# Altium project Heartbeat_board.PrjPcb
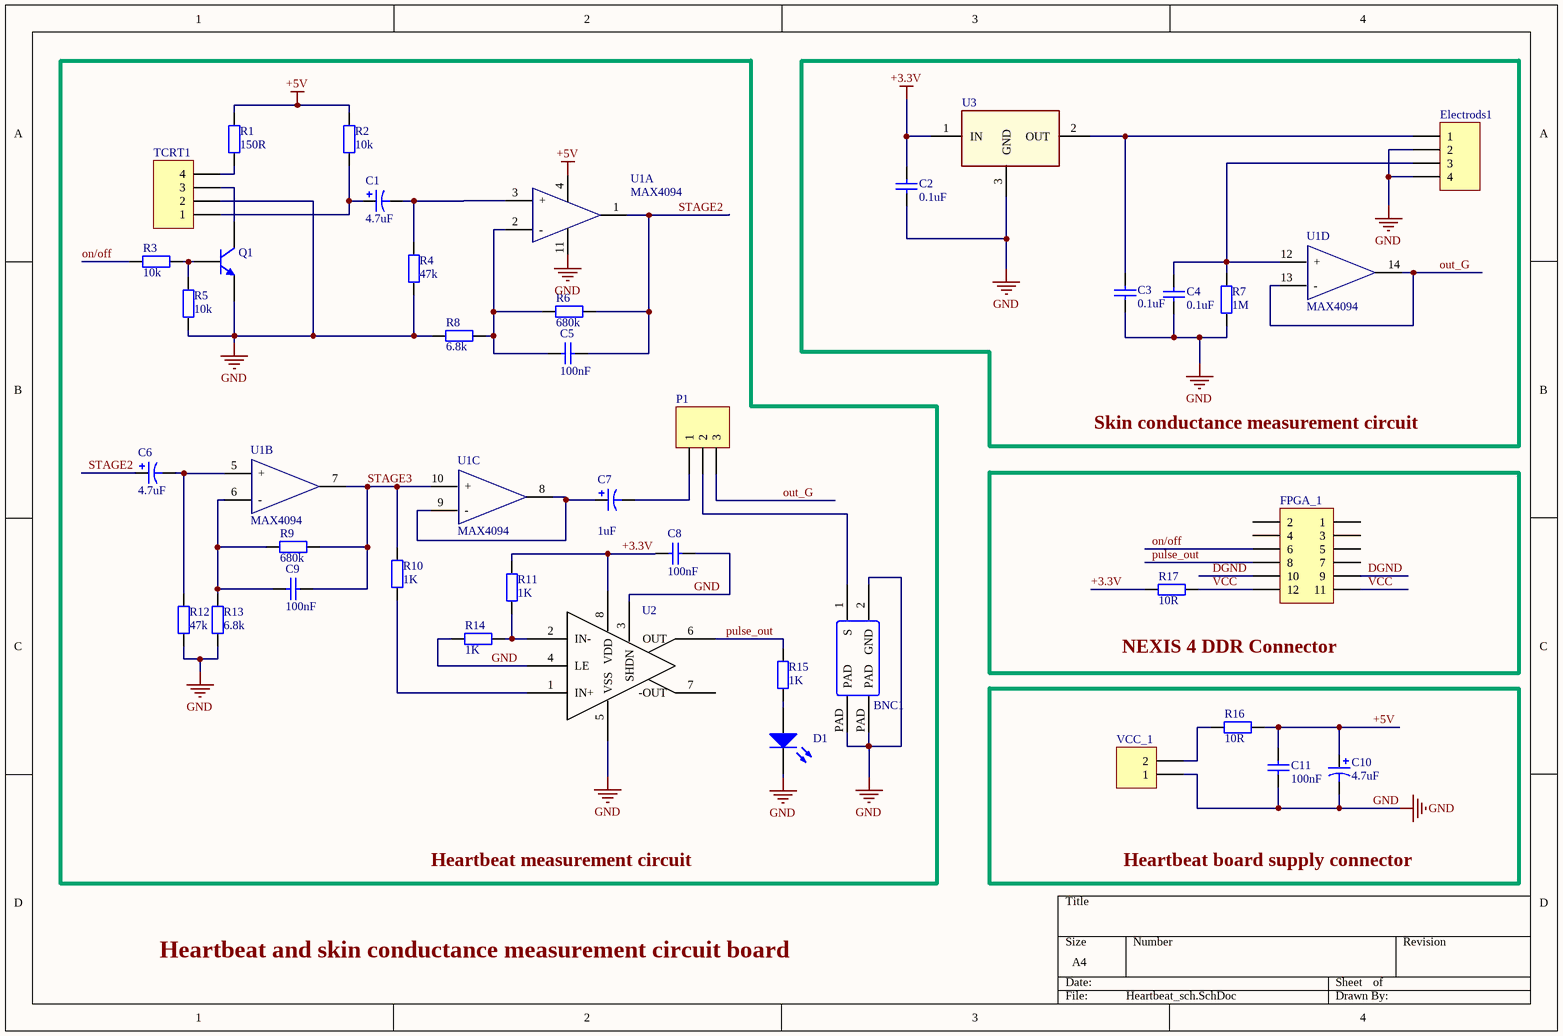
[diagram p0: Heartbeat_sch.SchDoc]
1 sheet, 39 parts. Net scope: global (net labels, ports and power ports of the same name join across sheets).
Board file: Heartbeat_pcb.PcbDoc

## Sheet Heartbeat_sch.SchDoc
size A4

### Parts
BNC1  BNC FEMALE CONN  [BNC CONNECTOR]  (value not drawn)
C1  value 4.7uF  [Condensator SMD tantal case A]  (hidden comment: Cap Pol1)
C2  value 0.1uF  [capacitor 2012[0805]]  (hidden comment: Cap)
C3  value 0.1uF  [capacitor 2012[0805]]  (hidden comment: Cap)
C4  value 0.1uF  [capacitor 2012[0805]]  (hidden comment: Cap)
C5  value 100nF  [capacitor 2012[0805]]  (hidden comment: Cap)
C6  value 4.7uF  [Condensator SMD tantal case A]  (hidden comment: Cap Pol1)
C7  value 1uF  [Condensator SMD tantal case A]  (hidden comment: Cap Pol1)
C8  value 100nF  [capacitor 2012[0805]]  (hidden comment: Cap)
C9  value 100nF  [capacitor 2012[0805]]  (hidden comment: Cap)
C10  value 4.7uF  [Condensator SMD tantal case A]  (hidden comment: Cap Pol1)
C11  value 100nF  [capacitor 2012[0805]]  (hidden comment: Cap)
D1  LED0  [led smd verde]  (value not drawn)
Electrods1  Header 4H  [HDR1X4H]  (value not drawn)
FPGA_1  Header 6X2H  [HDR2X6H]  (value not drawn)
P1  Header 3  [hdr3]  (value not drawn)
Q1  2N3904  [SOT23-3M]  (value not drawn)
R1  value 150R  [2012(rezistor)]  (hidden comment: Res2)
R2  value 10k  [2012(rezistor)]  (hidden comment: Res2)
R3  value 10k  [2012(rezistor)]  (hidden comment: Res2)
R4  value 47k  [2012(rezistor)]  (hidden comment: Res2)
R5  value 10k  [2012(rezistor)]  (hidden comment: Res2)
R6  value 680k  [2012(rezistor)]  (hidden comment: Res2)
R7  value 1M  [2012(rezistor)]  (hidden comment: Res2)
R8  value 6.8k  [2012(rezistor)]  (hidden comment: Res2)
R9  value 680k  [2012(rezistor)]  (hidden comment: Res2)
R10  value 1K  [2012(rezistor)]  (hidden comment: Res2)
R11  value 1K  [2012(rezistor)]  (hidden comment: Res2)
R12  value 47k  [2012(rezistor)]  (hidden comment: Res2)
R13  value 6.8k  [2012(rezistor)]  (hidden comment: Res2)
R14  value 1K  [2012(rezistor)]  (hidden comment: Res2)
R15  value 1K  [2012(rezistor)]  (hidden comment: Res2)
R16  value 10R  [2012(rezistor)]  (hidden comment: Res2)
R17  value 10R  [2012(rezistor)]  (hidden comment: Res2)
TCRT1  Header 4H  [HDR1X4H]  (value not drawn)
U1  MAX4094  [SOIC127P600-14M]  (parts A,B,C,D of 4)
U2  Component_1  [SOIC 8 pini]  (value not drawn)
U3  MAX6061  [SOT23-3_L]  (value not drawn)
VCC_1  Header 2  [HDR1X2]  (value not drawn)

### Blocks framed on the sheet
Heartbeat measurement circuit: BNC1 C1 C5-C9 D1 P1 Q1 R1-R6 R8-R15 TCRT1 U1 U2
Skin conductance measurement circuit: C2-C4 Electrods1 R7 U1 U3
NEXIS 4 DDR Connector: FPGA_1 R17
Heartbeat board supply connector: C10 C11 R16 VCC_1

### Nets
+3.3V: C2.2 C8.2 R11.1 R17.2 U2.8(VDD) U3.1(IN)
+5V: C10.1 C11.1 R1.2 R2.2 R16.1 U1.4
GND: BNC1.2(GND) BNC1.PAD C2.1 C3.1 C4.1 C8.1 C10.2 C11.2 D1.2(K) Electrods1.2 Electrods1.4 Q1.1(E) R4.2 R5.1 R7.1 R8.2 R12.2 R13.1 R14.1 TCRT1.2 U1.11 U2.3(SHDN) U2.4(LE) U2.5(VSS) U3.3(GND) VCC_1.1
DGND: FPGA_1.9 FPGA_1.10
on/off: FPGA_1.6 R3.2
out_G: P1.3 U1.13(-) U1.14(OUT)
pulse_out: FPGA_1.8 R15.1 U2.6(OUT)
STAGE2: C5.2 C6.1 R6.1 U1.1(OUT)
STAGE3: C9.1 R9.1 R10.1 U1.7(OUT) U1.10(+)
VCC: FPGA_1.11 FPGA_1.12 R17.1
NetBNC1_1: BNC1.1(S) P1.2
NetC1_1: C1.1 R2.1 TCRT1.1
NetC1_2: C1.2 R4.1 U1.3(+)
NetC3_2: C3.2 Electrods1.1 U3.2(OUT)
NetC4_2: C4.2 Electrods1.3 R7.2 U1.12(+)
NetC5_1: C5.1 R6.2 R8.1 U1.2(-)
NetC6_2: C6.2 R12.1 U1.5(+)
NetC7_1: C7.1 U1.8(OUT) U1.9(-)
NetC7_2: C7.2 P1.1
NetC9_2: C9.2 R9.2 R13.2 U1.6(-)
NetD1_1: D1.1(A) R15.2
NetQ1_2: Q1.2(B) R3.1 R5.2
NetQ1_3: Q1.3(C) TCRT1.3
NetR1_1: R1.1 TCRT1.4
NetR10_2: R10.2 U2.1(IN+)
NetR11_2: R11.2 R14.2 U2.2(IN-)
NetR16_2: R16.2 VCC_1.2

Not connected (* = marked no-connect by the designer): FPGA_1 1 2 3 4 5 7; U2 7(-OUT)

### Notes on the sheet
- Heartbeat and skin conductance measurement circuit board

### Library data of the parts
C1 C6 C7 C10 = Cap Pol1: Polarized Capacitor (Radial); Published: 8-Jun-2000; LatestRevisionDate: 17-Jul-2002; LatestRevisionNote: Re-released for DXP Platform.; PackageReference: RB7.6-15; Publisher: Altium Limited; PackageDescription: Polarized Capacitor (Radial); 2 Leads
C2-C5 C8 C9 C11 = Cap: Capacitor; Published: 8-Jun-2000; LatestRevisionDate: 17-Jul-2002; LatestRevisionNote: Re-released for DXP Platform.; PackageReference: RAD-0.3; Publisher: Altium Limited; PackageDescription: Radial Cap, Thru-Hole; 2 Leads; 0.3 in Pin Spacing
D1 = LED0: Typical INFRARED GaAs LED; Published: 8-Jun-2000; LatestRevisionDate: 08-Jul-2005; LatestRevisionNote: Mech Layer 1 removed.; PackageReference: LED-0; Publisher: Altium Limited; PackageDescription: LED; 2 Leads
Electrods1 TCRT1 = Header 4H: Header, 4-Pin, Right Angle; LatestRevisionDate: 17-Jul-2002; LatestRevisionNote: Re-released for DXP Platform.; Publisher: Altium Limited
FPGA_1 = Header 6X2H: Header, 6-Pin, Dual row, Right Angle; LatestRevisionDate: 17-Jul-2002; LatestRevisionNote: Re-released for DXP Platform.; Publisher: Altium Limited
P1 = Header 3: Header, 3-Pin; LatestRevisionDate: 17-Jul-2002; LatestRevisionNote: Re-released for DXP Platform.; Publisher: Altium Limited
Q1 = 2N3904: NPN General Purpose Amplifier; pin to pad: 1>2 2>1; Published: 8-Jun-2000; LatestRevisionDate: 15-Jan-2003; LatestRevisionNote: PCB Footprint 'BCY-W3/D4.7' replaced; DatasheetVersion: 1997; PackageVersion: Sep-1998; PackageReference: TO-92A; Publisher: Altium Limited; PackageDescription: TO, Flat Index; 3 In-Line, Axial Leads; Body Dia. 4.5mm; Leads 0.51 x 0.48 mm (max); ComponentLink1Description: Manufacturer Link; ComponentLink1URL: http://www.fairchildsemi.com/; ComponentLink2Description: Datasheet; ComponentLink2URL: http://www.fairchildsemi.com/ds/2N%2F2N3904.pdf
R1-R17 = Res2: Resistor; Published: 8-Jun-2000; LatestRevisionDate: 17-Jul-2002; LatestRevisionNote: Re-released for DXP Platform.; PackageReference: AXIAL-0.4; Publisher: Altium Limited; PackageDescription: Axial Device, Thru-Hole; 2 Leads; 0.4 in Pin Spacing
U3 = MAX6061: Precision, Micropower, Low-Dropout,  High-Output-Current, SOT23 Voltage References
VCC_1 = Header 2: Header, 2-Pin; LatestRevisionDate: 17-Jul-2002; LatestRevisionNote: Re-released for DXP Platform.; Publisher: Altium Limited